# EasyEDA Pro project 官方红板.epro, schematic 航模电池版2.0
Board Name: Board1_1; Create Date: 2025-07-22; Page Name: 2.0; Project Name: MSPM0小红; Schematic Name: 航模电池版2.0; Update Date: 2025-07-22; Company: 嘉立创EDA; Page Size: A4; Version: V1.0
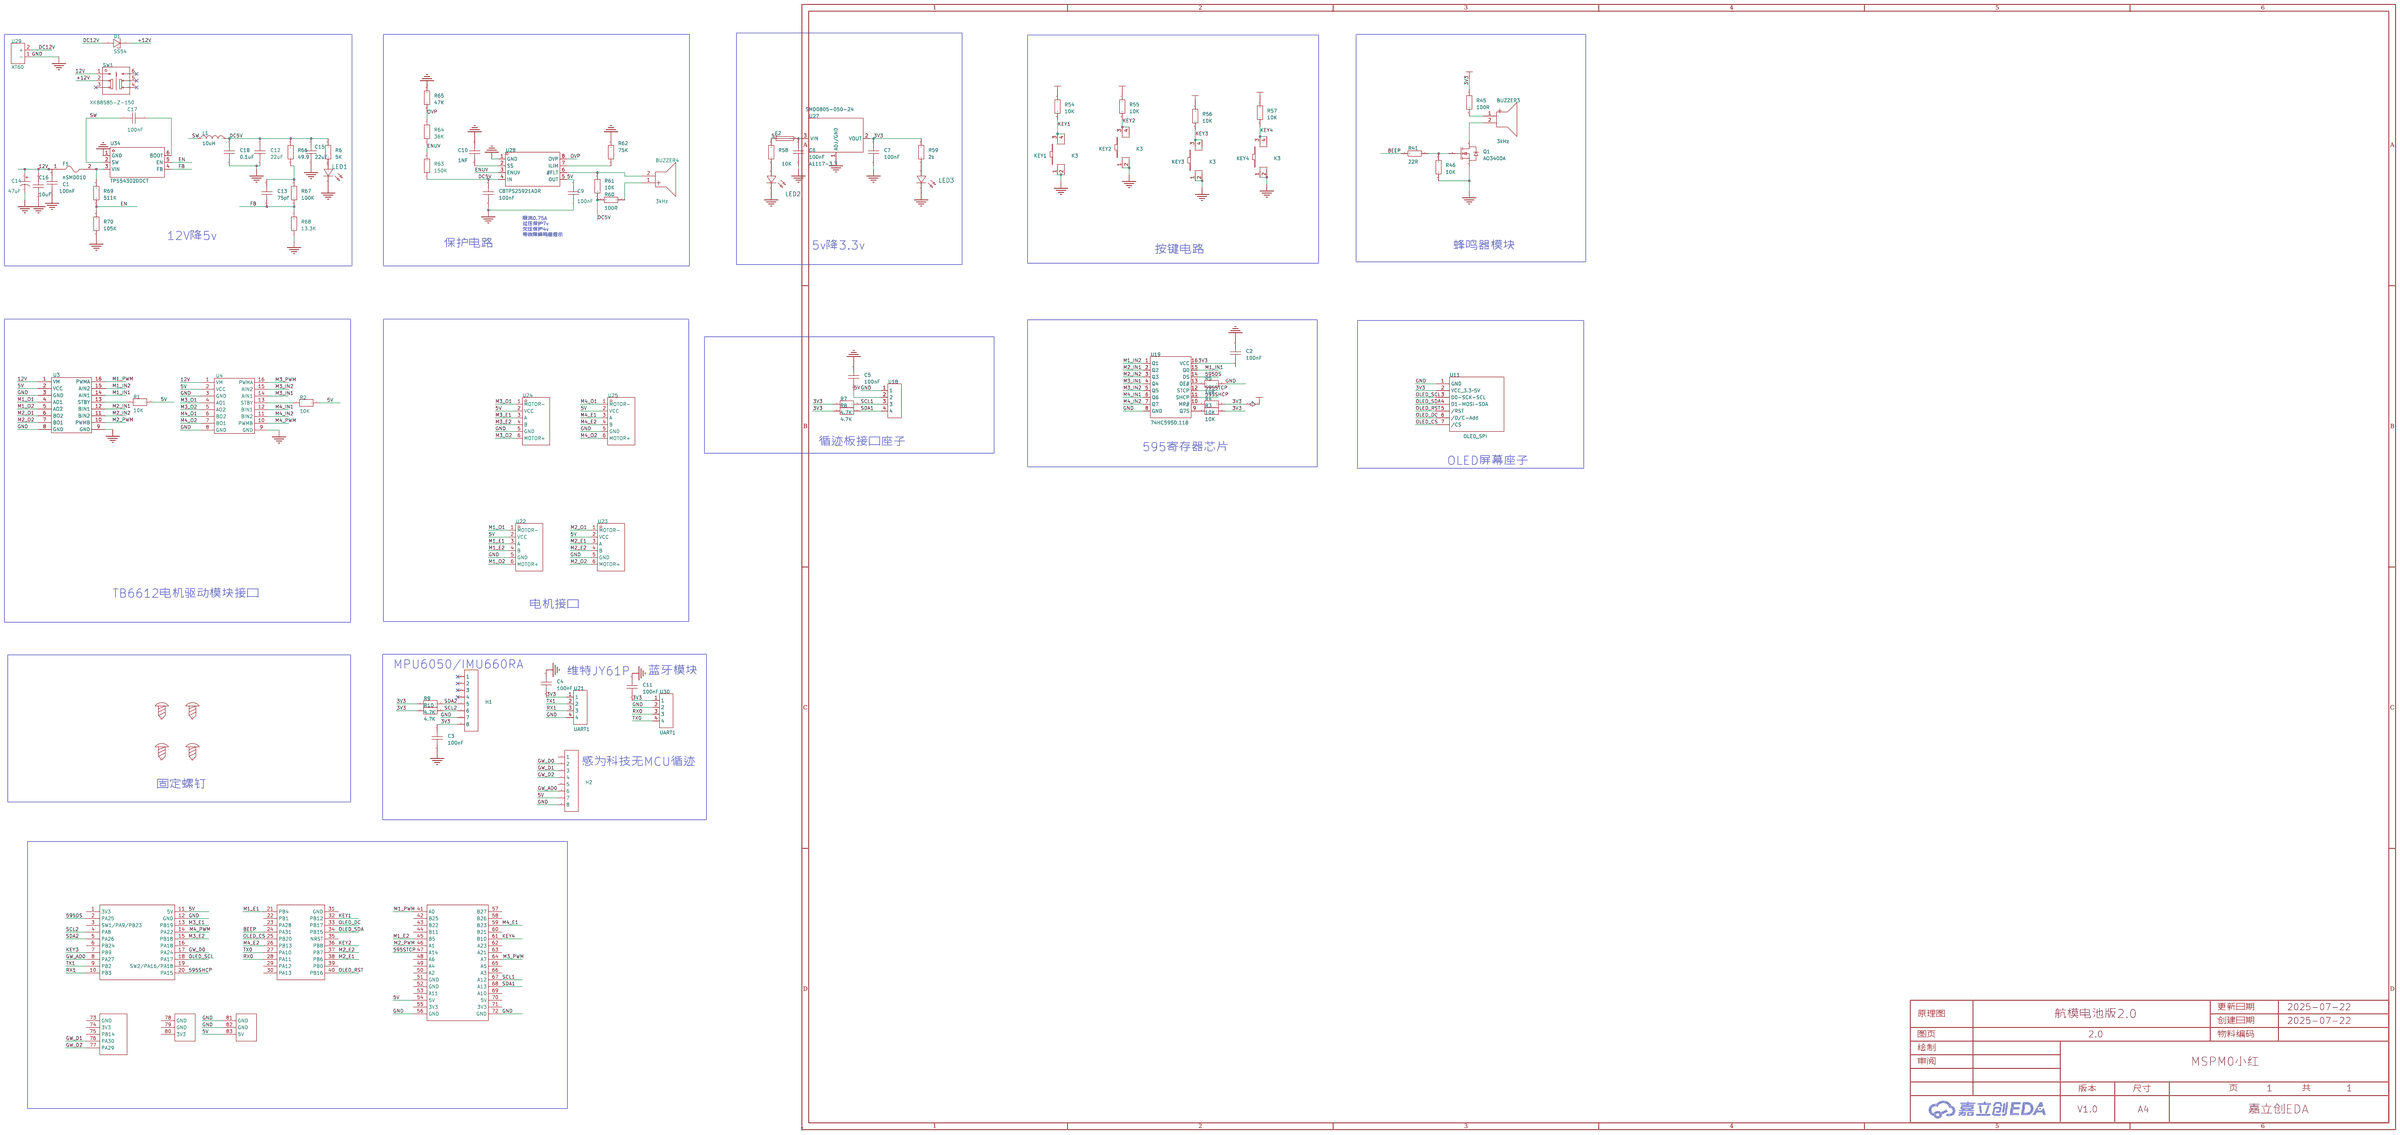
[diagram p0: schematic sheet]

## Parts
BUZZER3  3kHz  [BUZ-TH_BD9.0-P5.00-D0.6-FD]
BUZZER4  3kHz  [BUZ-TH_BD9.0-P5.00-D0.6-FD]
C1  100nF  [C0805]
C2  100nF  [C0603]
C3  100nF  [C0603]
C4  100nF  [C0603]
C5  100nF  [C0603]
C6  100nF  [C0603]
C7  100nF  [C0603]
C8  100nF  [C0603]
C9  100nF  [C0603]
C10  1NF  [C0603]
C11  100nF  [C0603]
C12  22uF  [C0603]
C13  75pf  [C0603]
C14  47uF  [CAP-TH_BD5.0-P2.00-D0.8-FD]
C15  22uF  [C0603]
C16  10uF  [C0805]
C17  100nF  [C0805]
C18  0.1uF  [C0603]
D1  SS54  [SMA_L4.3-W2.6-LS5.0-FD]
F1  nSMD010  [F1206]
F2  SMD0805-050-24  [F0805]
H1  -  [HDR-TH_8P-P2.54-V-F-1]
H2  -  [HDR-TH_8P-P2.54-V-F-1]
KEY1  K3  [KEY-TH_4P-L6.0-W6.0-P4.50]
KEY2  K3  [KEY-TH_4P-L6.0-W6.0-P4.50]
KEY3  K3  [KEY-TH_4P-L6.0-W6.0-P4.50]
KEY4  K3  [KEY-TH_4P-L6.0-W6.0-P4.50]
L1  10uH  [IND-SMD_L4.0-W4.0]
LED1  -  [LED_0805]
LED2  -  [LED_0603]
LED3  -  [LED_0603]
Q1  AO3400A  [SOT-23-3_L2.9-W1.3-P1.90-LS2.4-BR]
R1  10K  [C0603]
R2  10K  [C0603]
R3  10K  [C0603]
R4  10K  [C0603]
R5  10K  [C0603]
R6  5K  [R0603]
R7  4.7K  [C0603]
R8  4.7K  [C0603]
R9  4.7K  [C0603]
R10  4.7K  [C0603]
R41  22R  [R0603]
R45  100R  [R0603]
R46  10K  [R0603]
R54  10K  [R0603]
R55  10K  [R0603]
R56  10K  [R0603]
R57  10K  [R0603]
R58  10K  [R0603]
R59  2k  [R0603]
R60  100R  [R0603]
R61  10K  [R0603]
R62  75K  [R0603]
R63  150K  [R0603]
R64  36K  [R0603]
R65  47K  [R0603]
R66  49.9  [R0603]
R67  100K  [R0603]
R68  13.3K  [R0603]
R69  511K  [R0603]
R70  105K  [R0603]
SCREW1  -  [M3螺丝]
SCREW2  -  [M3螺丝]
SCREW3  -  [M3螺丝]
SCREW4  -  [M3螺丝]
SW1  XKB8585-Z-150  [SW-TH_6P-L8.5-W8.5-P2.50-LS5.4-BL-1]
U3  -  [TB6612]
U4  -  [TB6612]
U11  OLED_SPI  [0.96OLED_7P]
U18  PCA9555  [CONN-TH_4P-P2.50-XH2.54-4P]
U19  74HC595D,118  [SOIC-16_L9.9-W3.9-P1.27-LS6.0-BL]
U21  UART1  [CONN-TH_4P-P2.50-XH2.54-4P]
U22  -  [ZX-XH2.54-6PWZ]
U23  -  [ZX-XH2.54-6PWZ]
U24  -  [ZX-XH2.54-6PWZ]
U25  -  [ZX-XH2.54-6PWZ]
U27  A1117-3.3  [SOT-223-3_L6.5-W3.4-P2.30-LS7.0-BR-1]
U28  TPS25921ADR  [SOIC-8_L5.0-W4.0-P1.27-LS6.0-BL]
U29  XT60  [CONN-TH_XT60]
U30  UART1  [CONN-TH_4P-P2.50-XH2.54-4P]
U31  -  [MSPM0G3507新]
U34  TPS54302DDCT  [TSOT-23-6_L2.9-W1.6-P0.95-LS2.8-BR]

## Library data of the parts
BUZZER3 BUZZER4 = HNB09A03: 驱动方式:有源(内含驱动线路);构造类型:电磁式;频率:3kHz;声压(SPL):85dB;; LCSC Part Name: 电磁式有源一体蜂鸣器HNB09A03; Supplier Part: C96102; Manufacturer: 华能; Supplier Footprint: 插件,D=9mm; JLCPCB Part Class: 扩展库; Datasheet: https://atta.szlcsc.com/upload/public/pdf/source/20241128/61C4C8C3938BB25F7C38FBE94CCE8DCF.pdf; Supplier: LCSC; Driver Circuitry: 有源(内含驱动线路); Technology: 电磁式; Voltage - Supply: 1.5V~4.5V; Current Consumption: 30mA; Sound Pressure Level(SPL): 85dB; Diameter(φD): 9mm; Height: 5.5mm; Operating Temperature: -20℃~+70℃
C1 C13 C16 C17 = CAP_0805: Supplier Footprint: 0805
C2-C12 C15 C18 = CAP_0603: Supplier Footprint: 0603
C14 = EWH1VM470D11OT: 容值:47uF;精度:±20%;额定电压:35V;纹波电流:90mA@120Hz;等效串联电阻:-;; LCSC Part Name: 47uF ±20% 35V; Supplier Part: C105335; Manufacturer: AISHI(艾华集团); Supplier Footprint: 插件,D5xL11mm; Datasheet: https://atta.szlcsc.com/upload/public/pdf/source/20200106/C481308_16D735F9103482ADD8491C667D201AFA.pdf; Supplier: LCSC; Tolerance: ±20%; Rated Voltage: 35V; Ripple Current: 90mA@120Hz; Lead Spacing: 2mm; φD: 5mm; L: 11mm; Lifetime @ Temp: 2000hrs@105℃
D1 = SS54_C7420369: 二极管配置:独立式;正向压降(Vf):550mV@5.0A;直流反向耐压(Vr):40V;整流电流:5A;; LCSC Part Name: 电压:40V 电流:5A; Supplier Part: C7420369; Manufacturer: 宏迦橙; Supplier Footprint: SMA(DO-214AC); Datasheet: https://atta.szlcsc.com/upload/public/pdf/source/20230828/254C3882F8647358AD9F60DD73611B5E.pdf; Supplier: LCSC; Diode Configuration: 独立式; Forward Voltage (Vf@If): 550mV@5.0A; Reverse Voltage (Vr): 40V; Rectified Current: 5A; Reverse Leakage Current (Ir): 50uA@40V
F1 = nSMD010: 耐压:60V;最大电流:40A;保持电流(Ih):100mA;跳闸电流:250mA;; LCSC Part Name: 0.10A 60V 自恢复保险丝; Supplier Part: C70065; Manufacturer: 台湾陆海; Supplier Footprint: 1206; Datasheet: https://atta.szlcsc.com/upload/public/pdf/source/20230404/ADB19886462D98F83AD677B1F8114E76.pdf; Supplier: LCSC; Voltage - Max: 60V; Current - Max: 40A; Hold Current: 100mA; Trip Current: 250mA; Power Dissipation: -；-；-；-; Operating Temperature: -40℃~+85℃
F2 = SMD0805-050-24: 耐压(Vmax):24V;最大电流(Imax):40A;保持电流(Ihold):500mA;跳闸电流(Itrip):1A;; Supplier Part: C46640987; Manufacturer: 宏嘉诚; Supplier Footprint: 0805; JLCPCB Part Class: 扩展库; Datasheet: https://atta.szlcsc.com/upload/public/pdf/source/20250414/C7C75E40B18789A4A1352E9E468D2637.pdf; Supplier: LCSC; Voltage - Max: 24V; Current - Max: 40A; Hold Current: 500mA; Trip Current: 1A; Power Dissipation: 500mW; Resistance - Initial (Ri) (Min): 100mΩ; Resistance - Post Trip (R1) (Max): 850mΩ; Time to Trip(Max): 100ms; Operating Temperature: -40℃~+85℃
H1 H2 = HDR-F_2.54_1x8P: Supplier Part: C27438; Supplier Footprint: 插件
KEY1-KEY4 = 按键开关6*6*8.5: LCSC Part Name: 按键开关6*6*8.5   直插; Supplier Part: C59980; Supplier Footprint: 插件; JLCPCB Part Class: 扩展库; Supplier: LCSC
L1 = SWPA4030S100MT: 电感值:10uH;精度:±20%;额定电流:1.5A;饱和电流(Isat):2.4A;类型:-;; LCSC Part Name: 10uH ±20% 2.4A; Supplier Part: C38117; Manufacturer: Sunlord(顺络); Supplier Footprint: SMD,4x4mm; Datasheet: https://atta.szlcsc.com/upload/public/pdf/source/20231024/317626D2AA2F8AB4113C1875E432E6E1.pdf; Supplier: LCSC; Tolerance: ±20%; Rated Current: 1.5A; Current - Saturation(Isat): 2.4A; DC Resistance(DCR): 130mΩ
LED1 = LED_0805-R: Supplier Footprint: 0805
LED2 LED3 = LED_0603-R: Supplier Footprint: 0603
Q1 = AO3400A_C20917: 类型:1个N沟道;漏源电压(Vdss):30V;连续漏极电流(Id):5.7A;导通电阻(RDS(on)@Vgs,Id):26.5mΩ@10V,5.7A;功率(Pd):1.4W;阈值电压(Vgs(th)@Id):1.5V@250uA;; LCSC Part Name: 1个N沟道 耐压:30V 电流:5.7A; Supplier Part: C20917; Manufacturer: AOS; Supplier Footprint: SOT-23-3L; JLCPCB Part Class: 基础库; Datasheet: https://atta.szlcsc.com/upload/public/pdf/source/20140107/1457706668533.pdf; Supplier: LCSC; Type: 1个N沟道; Drain Source Voltage (Vdss): 30V; Continuous Drain Current (Id): 5.7A; Drain Source On Resistance (RDS(on)@Vgs,Id): 26.5mΩ@10V,5.7A; Power Dissipation (Pd): 1.4W; Gate Threshold Voltage (Vgs(th)@Id): 1.5V@250uA; Total Gate Charge (Qg@Vgs): 7nC@4.5V; Input Capacitance (Ciss@Vds): 630pF@15V; Operating Temperature: -55℃~+150℃@(Tj)
R1-R5 R7-R10 = RGT1608P-4990-B-T5: 电阻类型:薄膜电阻;阻值:499Ω;精度:±0.1%;功率:62.5mW;最大工作电压:100V;温度系数:±25ppm/℃;; LCSC Part Name: 薄膜电阻 499Ω ±0.1% 62.5mW; Supplier Part: C2083102; Manufacturer: SUSUMU; Supplier Footprint: 0603; JLCPCB Part Class: 扩展库; Datasheet: https://atta.szlcsc.com/upload/public/pdf/source/20210602/FAF6903AD06801EB9B5BD9535AC54790.pdf; Supplier: LCSC; Type: 薄膜电阻; Tolerance: ±0.1%; Power(Watts): 62.5mW; Overload Voltage (Max): 100V; Temperature Coefficient: ±25ppm/℃; Operating Temperature Range: -55℃~+175℃
R6 R66-R70 = Res_0805: Supplier Footprint: 0805
R41 R45 R46 R54-R65 = Res_0603: Supplier Footprint: 0603
SCREW1-SCREW4 = M3螺丝: Supplier Footprint: 插件
SW1 = XKB8585-Z-150: 电路结构:-;自锁/无锁:自锁;安装方式:直插;触点电流:100mA;额定电压 (AC):250V;额定电压 (DC):30V;带灯:不带;作用力:160gf;机械寿命:10万次;; LCSC Part Name: 按键开关   六脚 内扣 有声自锁; Supplier Part: C318850; Manufacturer: XKB Connectivity(中国星坤); Supplier Footprint: 插件; JLCPCB Part Class: 扩展库; Datasheet: https://atta.szlcsc.com/upload/public/pdf/source/20200227/C318850_BEC742BC33DEE736D7E5FB22B903A157.pdf; Supplier: LCSC; Self Lock / No Lock: 自锁; Actuator Style: 方形按钮; Mounting Style: 直插; Contact Current: 100mA; Voltage Rating (AC): 250V; Voltage Rating (DC): 30V; Insulation Resistance: 100MΩ; Actuator/Cap Color: 白色; With Lamp: 不带; Pin Style: PC引脚; Operating Force: 160gf; Operating Temperature: -15℃~+55℃; Mechanical Life: 10万次
U3 U4 = TB6612
U11 = OLED_7P: Pin Type: IN
U18 U21 U30 = XH2.54_4P_直插: Supplier Part: C9900008616; Supplier Footprint: XH2.54_4P; JLCPCB Part Class: 扩展库; Supplier: LCSC
U19 = 74HC595D,118: 功能:串行至串行或并行;电源电压:2V~6V;元件数:1;每个元件位数:8;; LCSC Part Name: 三态输出 串行至串行或并行移位寄存器; Supplier Part: C5947; Manufacturer: Nexperia(安世); Supplier Footprint: SOIC-16; JLCPCB Part Class: 基础库; Datasheet: https://atta.szlcsc.com/upload/public/pdf/source/20240724/C3A3241CA190230F407C83CEC4244600.pdf; Supplier: LCSC; Function: 串行至串行或并行; Supply Voltage: 2V~6V; Number of Elements: 1; Number of Bits per Element: 8; Output Type: 三态; Series: 74HC; Operating Temperature: -40℃~+125℃
U22-U25 = Motor-6Pin
U27 = A1117-3.3: 输出电流:1A;; LCSC Part Name: AMS1117-3.3; Supplier Part: C7432020; Manufacturer: IDCHIP(英锐芯); Supplier Footprint: SOT-223; JLCPCB Part Class: 扩展库; Datasheet: https://atta.szlcsc.com/upload/public/pdf/source/20230625/435FEEFA02C0FE449E7397A11F8448E0.pdf; Supplier: LCSC; Output Current: 1A; Features: 热关断(TSD)；过流保护(OCP)
U28 = TPS25921ADR: TPS25921A 具有自动重试故障响应功能的 4.5V 至 18V、90mΩ、0.4A 至 1.6A 电子保险丝; Supplier Part: C189199; Manufacturer: TI(德州仪器); Supplier Footprint: SOIC-8; JLCPCB Part Class: 扩展库; Datasheet: https://www.ti.com/cn/lit/gpn/tps25921a; Supplier: LCSC
U29 = XT60: 类别:-;类型1:-;; LCSC Part Name: AMASS(艾迈斯) XT60模型插头 3.5mm镀金香蕉头公头（电调端）XT60-M; Supplier Part: C98733; Manufacturer: AMASS(艾迈斯); JLCPCB Part Class: 扩展库; Datasheet: https://atta.szlcsc.com/upload/public/pdf/source/20170606/1496716524919.pdf; Supplier: LCSC; Type: 香蕉头; Colour: 黄色; InterfaceType: 公头; specifications: 3.5mm
U31 = MSPM0G3507
U34 = TPS54302DDCT: 功能类型:降压型;输出类型:可调;工作电压:4.5V~28V;输出电压:596mV~28V;输出电流:3A;; LCSC Part Name: 4.5V至28V输入,3A输出,低EMI同步降压转换器; Supplier Part: C129370; Manufacturer: TI(德州仪器); Supplier Footprint: TSOT-23-6; JLCPCB Part Class: 扩展库; Datasheet: https://www.ti.com/cn/lit/gpn/tps54302; Supplier: LCSC; Function: 降压型; Output Type: 可调; Input Voltage: 4.5V~28V; Output Voltage: 596mV~28V; Output Current: 3A; Switching Frequency: 400kHz; Operating Temperature: -40℃~+125℃@(TJ); Synchronous Rectification: 是; Number of Outputs: 1; Topology: 降压式; Switch tube (built-in/external): 内置

## Nets
5V: C5.2 C9.2 F2.1 H2.7 R1.2 R2.2 R58.2 U3.2(VCC) U4.2(VCC) U18.2 U22.2(VCC) U23.2(VCC) U24.2(VCC) U25.2(VCC) U28.5(OUT) U31.11(5V) U31.54(5V) U31.83(5V)
12V: C1.2 C14.1 C16.2 F1.1 SW1.1 U3.1(VM) U4.1(VM)
+3.3V: C2.1 C3.2 C4.1 C7.2 C11.1 H1.8 R3.2 R4.2 R7.1 R8.1 R9.1 R10.1 R45.1 R54.1 R55.1 R56.1 R57.1 R59.2 U11.2(VCC 3.3~5V) U19.16(VCC) U21.1 U27.2(VOUT) U30.1
+12V: D1.2(K) SW1.2
GND: C1.1 C2.2 C3.1 C4.2 C5.1 C6.1 C7.1 C8.1 C9.1 C10.1 C11.2 C12.1 C14.2 C15.1 C16.1 C18.1 H1.7 H2.8 KEY1.1 KEY1.2 KEY2.1 KEY2.2 KEY3.1 KEY3.2 KEY4.1 KEY4.2 LED1.1(C) LED2.1(C) LED3.1(C) Q1.2(S) R5.2 R46.1 R62.2 R65.1 R68.1 R70.1 U3.3(GND) U3.8(GND) U3.9(GND) U4.3(GND) U4.8(GND) U4.9(GND) U11.1(GND) U18.1 U19.8(GND) U21.4 U22.5(GND) U23.5(GND) U24.5(GND) U25.5(GND) U27.1(ADJ/GND) U28.1(GND) U29.1(-) U30.2 U31.12(GND) U31.56(GND) U31.72(GND) U31.81(GND) U31.82(GND) U34.1(GND)
595DS: U19.14(DS) U31.2(PA25)
595SHCP: U19.11(SHCP) U31.20(PA15)
595STCP: U19.12(STCP) U31.47(A14)
BEEP: R41.2 U31.24(PA31)
DC5V: C8.2 C12.2 C15.2 C18.2 L1.2 R6.2 R60.1 R61.1 R63.1 R66.2 U28.4(IN)
DC12V: D1.1(A) U29.2(+)
EN: R69.1 R70.2 U34.5(EN)
ENUV: R63.2 R64.1 U28.3(ENUV)
FB: C13.1 R67.1 R68.2 U34.4(FB)
GW_AD0: H2.6 U31.8(PA27)
GW_D0: H2.2 U31.17(PA24)
GW_D1: H2.3 U31.76(PA30)
GW_D2: H2.4 U31.77(PA29)
KEY1: KEY1.3 KEY1.4 R54.2 U31.32(PB12)
KEY2: KEY2.3 KEY2.4 R55.2 U31.36(PB8)
KEY3: KEY3.3 KEY3.4 R56.2 U31.7(PB9)
KEY4: KEY4.3 KEY4.4 R57.2 U31.61(B10)
M1_E1: U22.3(A) U31.21(PB4)
M1_E2: U22.4(B) U31.45(B5)
M1_IN1: U3.14(AIN1) U19.15(Q0)
M1_IN2: U3.15(AIN2) U19.1(Q1)
M1_O1: U3.4(AO1) U22.1(MOTOR-)
M1_O2: U3.5(AO2) U22.6(MOTOR+)
M1_PWM: U3.16(PWMA) U31.41(A0)
M2_E1: U23.3(A) U31.38(PB6)
M2_E2: U23.4(B) U31.37(PB7)
M2_IN1: U3.12(BIN1) U19.2(Q2)
M2_IN2: U3.11(BIN2) U19.3(Q3)
M2_O1: U3.6(BO2) U23.1(MOTOR-)
M2_O2: U3.7(BO1) U23.6(MOTOR+)
M2_PWM: U3.10(PWMB) U31.46(A1)
M3_E1: U24.3(A) U31.13(PB19)
M3_E2: U24.4(B) U31.15(PB18)
M3_IN1: U4.14(AIN1) U19.4(Q4)
M3_IN2: U4.15(AIN2) U19.5(Q5)
M3_O1: U4.4(AO1) U24.1(MOTOR-)
M3_O2: U4.5(AO2) U24.6(MOTOR+)
M3_PWM: U4.16(PWMA) U31.64(A7)
M4_E1: U25.3(A) U31.59(B23)
M4_E2: U25.4(B) U31.26(PB13)
M4_IN1: U4.12(BIN1) U19.6(Q6)
M4_IN2: U4.11(BIN2) U19.7(Q7)
M4_O1: U4.6(BO2) U25.1(MOTOR-)
M4_O2: U4.7(BO1) U25.6(MOTOR+)
M4_PWM: U4.10(PWMB) U31.14(PA22)
OLED_CS: U11.7(/CS) U31.25(PB20)
OLED_DC: U11.6(/D/C-Add) U31.33(PB17)
OLED_RST: U11.5(/RST) U31.40(PB16)
OLED_SCL: U11.3(D0-SCK-SCL) U31.18(PA17)
OLED_SDA: U11.4(D1-MOSI-SDA) U31.34(PB15)
OVP: R64.2 R65.2 U28.8(OVP)
RX0: U30.3 U31.28(PA11)
RX1: U21.3 U31.10(PB3)
SCL1: R7.2 U18.3 U31.67(A12)
SCL2: H1.6 R10.2 U31.4(PA8)
SDA1: R8.2 U18.4 U31.68(A13)
SDA2: H1.5 R9.2 U31.5(PA26)
SW: C17.1 L1.1 U34.2(SW)
TX0: U30.4 U31.27(PA10)
TX1: U21.2 U31.9(PB2)
$1N3300: R1.1 U3.13(STBY)
$1N3306: R2.1 U4.13(STBY)
$1N3954: R3.1 U19.9(Q7S)
$1N3999: R4.1 U19.10(MR#)
$1N4038: R5.1 U19.13(OE#)
$1N7178: Q1.1(G) R41.1 R46.2
$1N9172: LED2.2(A) R58.1
$1N14720: BUZZER3.1(+) R45.2
$1N14723: BUZZER3.2(-) Q1.3(D)
$1N15095: LED3.2(A) R59.1
$1N17140: C6.2 F2.2 U27.3(VIN)
$1N22095: BUZZER4.1(+) R60.2
$1N22604: C10.2 U28.2(SS)
$1N22844: R62.1 U28.7(ILIM)
$1N22851: BUZZER4.2(-) R61.2 U28.6(#FLT)
$1N30930: C17.2 U34.6(BOOT)
$1N30940: F1.2 R69.2 U34.3(VIN)
$1N30948: C13.2 R66.1 R67.2
$1N30951: LED1.2(A) R6.1

Not connected (* = marked no-connect by the designer): H1 1* 2* 3* 4*; H2 1 5; SCREW1 1; SCREW2 1; SCREW3 1; SCREW4 1; SW1 3* 4* 5* 6*; U31 1(3V3) 3(SW1/PA9/PB23) 6(PB24) 16(PA18) 19(SW2/PA16/PA18) 22(PB1) 23(PA28) 29(PA12) 30(PA13) 31(GND) 35(NRST) 39(PB0) 42(B25) 43(B22) 44(B11) 48(A6) 49(A4) 50(A2) 51(GND) 52(GND) 53(A11) 55(3V3) 57(B27) 58(B26) 60(B21) 62(A23) 63(A21) 65(A5) 66(A3) 69(A10) 70(5V) 71(3V3) 73(GND) 74(3V3) 75(PB14) 78(GND) 79(GND) 80(3V3)

## Notes on the sheet
- 限流0.75A
  过压保护7v
  欠压保护4v
  带故障蜂鸣器提示
- 12V降5v
- 保护电路
- 5v降3.3v
- 按键电路
- 蜂鸣器模块
- 循迹板接口座子
- 595寄存器芯片
- OLED屏幕座子
- TB6612电机驱动模块接口
- 电机接口
- MPU6050/IMU660RA
- 维特JY61P
- 蓝牙模块
- 感为科技无MCU循迹
- 固定螺钉
